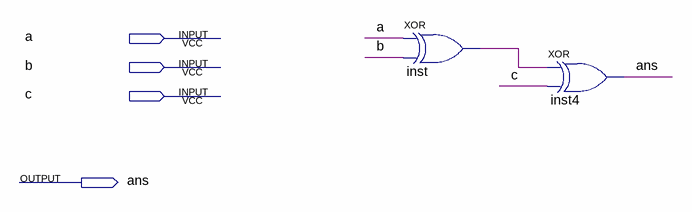
[diagram p0: schematic sheet]
// Quartus schematic FullAdder.bdf as structural Verilog: 2 symbols, 4 pins
module FullAdder (
  input  a,
  input  b,
  input  c,
  output ans
);

  wire inst_out;

  xor inst (inst_out, a, b);
  xor inst4 (ans, inst_out, c);
endmodule
